# EAGLE design 328+ch340g (EAGLE 6.5.0)
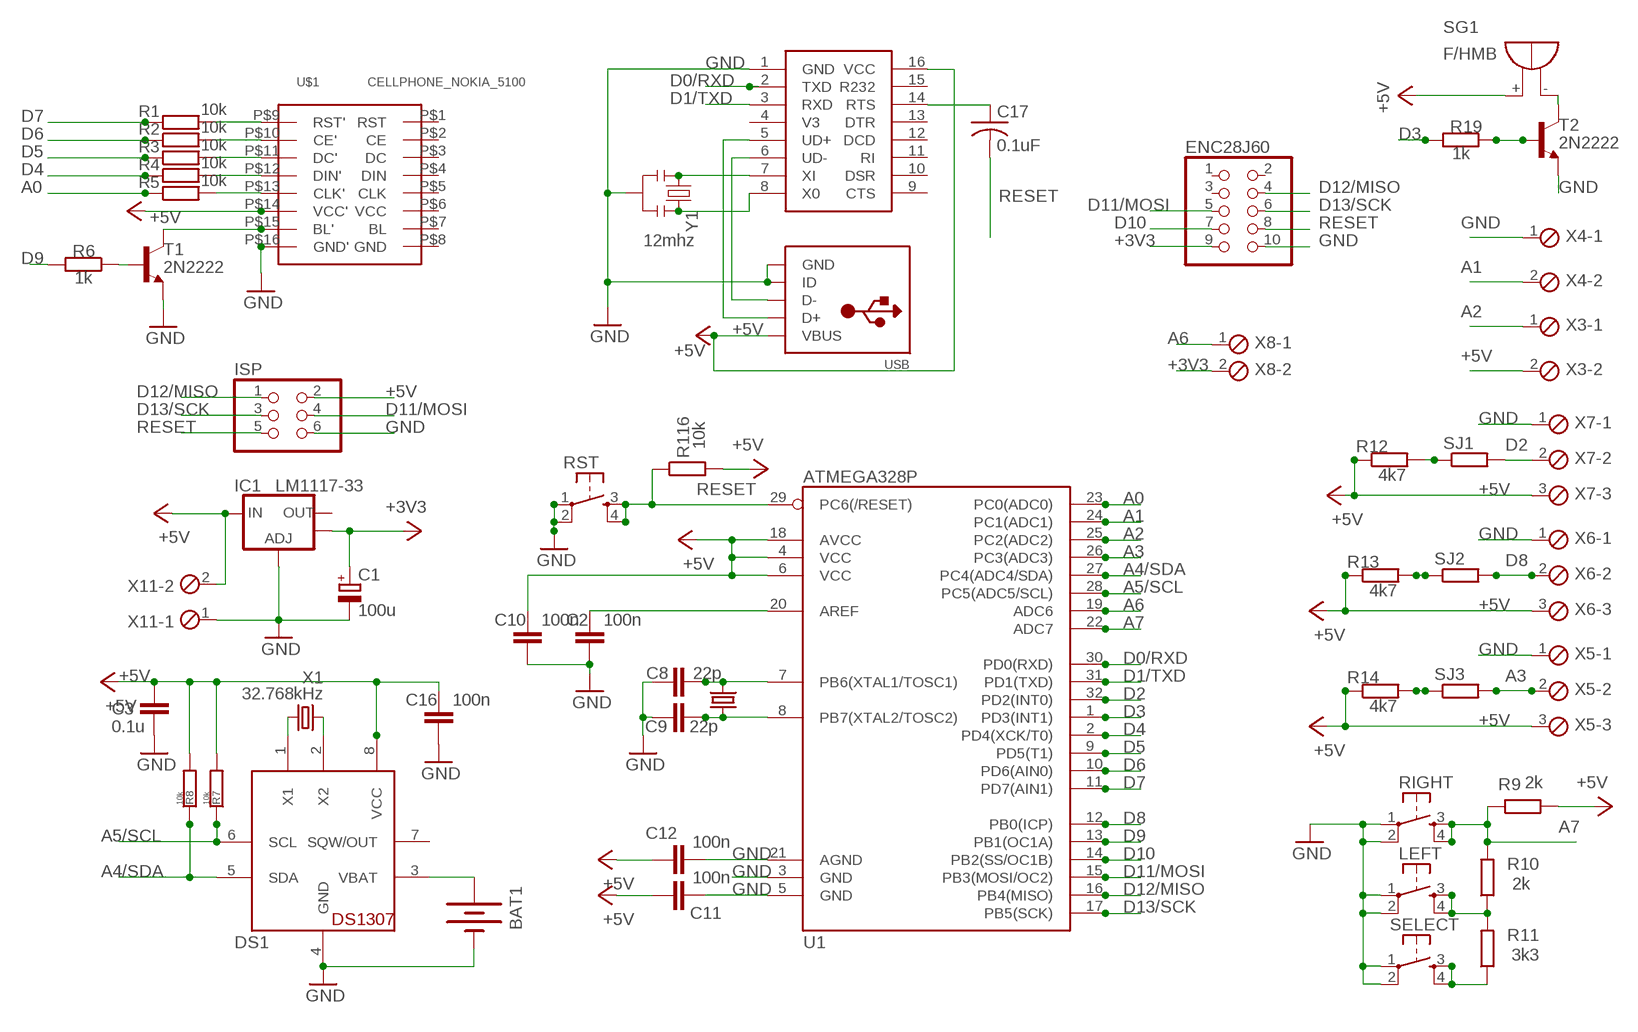
[diagram p0: schematic, sheet 1]

## Parts
BAT1  BATTERY20PTH  [BATTCOM_20MM_PTH]
C1  100u  CPOL-EUE2-5  [E2-5]
C2  100n  C-EUC0805  [C0805]
C3  0.1u  C-EUC0805  [C0805]
C8  22p  C-EUC0805  [C0805]
C9  22p  C-EUC0805  [C0805]
C10  100n  C-EUC0805  [C0805]
C11  100n  C-EUC0805  [C0805]
C12  100n  C-EUC0805  [C0805]
C16  100n  C-EUC0805  [C0805]
C17  0.1uF  C-USC0805K  [C0805K]
DS1  DS1307  DS1307SOIC  [SO08]
ENC28J60  PINHD-2X5  [2X05]
IC1  LM1117-33  V_REG_LM1117SOT223  [SOT223]
ISP  PINHD-2X3  [2X03]
LEFT  TAC_SWITCHPTH  [TACTILE-PTH]
R1  10k  R-EU_R0805  [R0805]
R2  10k  R-EU_R0805  [R0805]
R3  10k  R-EU_R0805  [R0805]
R4  10k  R-EU_R0805  [R0805]
R5  10k  R-EU_R0805  [R0805]
R6  1k  R-EU_R0805  [R0805]
R7  10k  R-EU_R0805  [R0805]
R8  10k  R-EU_R0805  [R0805]
R9  2k  R-EU_R0805  [R0805]
R10  2k  R-EU_R0805  [R0805]
R11  3k3  R-EU_R0805  [R0805]
R12  4k7  R-EU_R0805  [R0805]
R13  4k7  R-EU_R0805  [R0805]
R14  4k7  R-EU_R0805  [R0805]
R19  1k  R-EU_R0805  [R0805]
R116  10k  R-EU_R0805  [R0805]
RIGHT  TAC_SWITCHPTH  [TACTILE-PTH]
RST  TAC_SWITCHPTH  [TACTILE-PTH]
SELECT  TAC_SWITCHPTH  [TACTILE-PTH]
SG1  F/HMB  [F/HMB]
SJ1  R-EU_R0402  [R0402]
SJ2  R-EU_R0402  [R0402]
SJ3  R-EU_R0402  [R0402]
T1  2N2222  [TO92-EBC-OVAL]
T2  2N2222  [TO92-EBC-OVAL]
U1  ATMEGA328P  ATMEGA328_SMT  [TQFP32-08]
U$1  CELLPHONE_NOKIA_5100  [CELLPHONE_NOKIA_5100_SPARKFUN]
U$2  CH340G  [SO016]
USB  USBMOLEX  [USB-MINIB-THM-MOLEX]
X1  32.768kHz  CRYSTALTC26H  [TC26H]
X2  16MHz  CRYSTALHC49US  [HC49US]
X3  MPT2  [2POL254]
X4  MPT2  [2POL254]
X5  MPT3  [3POL254]
X6  MPT3  [3POL254]
X7  MPT3  [3POL254]
X8  MPT2  [2POL254]
X11  MPT2  [2POL254]
Y1  12mhz  RESONATORPTH  [RESONATOR-PTH]

## Nets
+3V3: C1.+ ENC28J60.9 IC1.4(OUT) X8.2
+5V: C3.1 C10.1 C11.2 C12.2 C16.1 DS1.8(VCC) IC1.3(IN) ISP.2 R7.2 R8.2 R9.2 R12.1 R13.1 R14.1 R116.2 SG1.+ U1.4(VCC) U1.6(VCC) U1.18(AVCC) U$1.P$14(VCC') U$2.16(VCC) USB.VBUS X3.2 X5.3 X6.3 X7.3 X11.2
A0: R5.1 U1.23(PC0(ADC0))
A1: U1.24(PC1(ADC1)) X4.2
A2: U1.25(PC2(ADC2)) X3.1
A3: SJ3.2 U1.26(PC3(ADC3)) X5.2
A4/SDA: DS1.5(SDA) R8.1 U1.27(PC4(ADC4/SDA))
A5/SCL: DS1.6(SCL) R7.1 U1.28(PC5(ADC5/SCL))
A6: U1.19(ADC6) X8.1
A7: R9.1 R10.2 RIGHT.3 RIGHT.4 U1.22(ADC7)
D0/RXD: U1.30(PD0(RXD)) U$2.2(TXD)
D1/TXD: U1.31(PD1(TXD)) U$2.3(RXD)
D2: SJ1.2 U1.32(PD2(INT0)) X7.2
D3: R19.2 U1.1(PD3(INT1))
D4: R4.1 U1.2(PD4(XCK/T0))
D5: R3.1 U1.9(PD5(T1))
D6: R2.1 U1.10(PD6(AIN0))
D7: R1.1 U1.11(PD7(AIN1))
D8: SJ2.2 U1.12(PB0(ICP)) X6.2
D9: R6.2 U1.13(PB1(OC1A))
D10: ENC28J60.7 U1.14(PB2(SS/OC1B))
D11/MOSI: ENC28J60.5 ISP.4 U1.15(PB3(MOSI/OC2))
D12/MISO: ENC28J60.4 ISP.1 U1.16(PB4(MISO))
D13/SCK: ENC28J60.6 ISP.3 U1.17(PB5(SCK))
GND: BAT1.2(-) C1.- C2.2 C3.2 C8.1 C9.1 C10.2 C11.1 C12.1 C16.2 DS1.4(GND) ENC28J60.10 IC1.1(ADJ) ISP.6 LEFT.1 LEFT.2 RIGHT.1 RIGHT.2 RST.1 RST.2 SELECT.1 SELECT.2 T1.E T2.E U1.3(GND) U1.5(GND) U1.21(AGND) U$1.P$16(GND') U$2.1(GND) USB.GND USB.ID X4.1 X5.1 X6.1 X7.1 X11.1 Y1.2
N$1: LEFT.3 LEFT.4 R10.1 R11.2
N$2: R5.2 U$1.P$13(CLK')
N$3: R4.2 U$1.P$12(DIN')
N$4: R3.2 U$1.P$11(DC')
N$5: R2.2 U$1.P$10(CE')
N$6: R1.2 U$1.P$9(RST')
N$7: BAT1.1(+) DS1.3(VBAT)
N$8: DS1.1(X1) X1.2
N$10: U$2.7(XI) Y1.1
N$11: U$2.6(UD-) USB.D-
N$15: U$2.5(UD+) USB.D+
N$17: R13.2 SJ2.1
N$18: R11.1 SELECT.3 SELECT.4
N$26 [signal]: T1.C U$1.P$15(BL')
N$27: R19.1 T2.B
N$28: R14.2 SJ3.1
N$29: SG1.- T2.C
N$30: DS1.2(X2) X1.1
N$31: R12.2 SJ1.1
N$32: C9.2 U1.8(PB7(XTAL2/TOSC2)) X2.1
N$33: C8.2 U1.7(PB6(XTAL1/TOSC1)) X2.2
N$35: C2.1 U1.20(AREF)
N$40: U$2.8(X0) Y1.3
N$43: C17.1 U$2.14(RTS)
N$44: R6.1 T1.B
RESET: C17.2 ENC28J60.8 ISP.5 R116.1 RST.3 RST.4 U1.29(PC6(/RESET))
Unconnected: DS1.7(SQW/OUT) ENC28J60.1 ENC28J60.2 ENC28J60.3 IC1.2(OUT) U$1.P$1(RST) U$1.P$2(CE) U$1.P$3(DC) U$1.P$4(DIN) U$1.P$5(CLK) U$1.P$6(VCC) U$1.P$7(BL) U$1.P$8(GND) U$2.4(V3) U$2.9(CTS) U$2.10(DSR) U$2.11(RI) U$2.12(DCD) U$2.13(DTR) U$2.15(R232)

## Library data of the parts
BAT1 = SparkFun-Electromechanical:BATTERY: Battery Holders Various common sizes : AA, AAA, 20mm coin cell and 12mm coin cell. 20MM_4LEGS, BATT-10373
C1 = resistor:CPOL-EU: POLARIZED CAPACITOR, European symbol
C2 C8-C12 C16 = resistor:C-EU: CAPACITOR, European symbol
C3 = rcl:C-EU: CAPACITOR, European symbol
C17 = rcl:C-US: CAPACITOR, American symbol
DS1 = adafruit:DS1307: DS1307 Real time clock (RTC) with battery backup ability. Talk to it via i2c
ENC28J60 = pinhead:PINHD-2X5: PIN HEADER
IC1 = SparkFun:V_REG_LM1117: Voltage Regulator LM1117 Standard adjustable voltage regulator but in SMD form. Spark Fun Electronics SKU : COM-00595
ISP = pinhead:PINHD-2X3: PIN HEADER
LEFT RIGHT RST SELECT = SparkFun-Electromechanical:TAC_SWITCH: Momentary Switch Button commonly used for reset or general input. Spark Fun Electronics SKU : COM-00097 SMT- SWCH-08247
R1-R14 R19 R116 SJ1-SJ3 = rcl:R-EU_: RESISTOR, European symbol
SG1 = buzzer:F/HMB: BUZZER Source: Buerklin; OC_FARNELL: unknown; OC_NEWARK: unknown
T1 T2 = adafruit:2N2222: NPN TRANSISTOR Big oval pads
U1 = SparkFun-DigitalIC:ATMEGA328_SMT: 32-Pin Atmega328 part Commonly used on Arduino compatible boards Available in QFP and QFN packages TQFP is IC-09069 QFN is non-stock; PROD_ID: IC-09069
U$1 = DIY-Cellphone:CELLPHONE_NOKIA_5100
U$2 = ch340:CH340G: CH340G
USB = adafruit:USB: USB Connectors USBMINIB - Surface Mount Female Mini-B USB Connector 4UConnector: 06564 By microbuilder.eu Thru-hole RA Female Mini-B USB Connector 4UConnector: 18732 By ladyada.net
X1 = crystal:CRYSTAL: CRYSTAL; OC_FARNELL: unknown; OC_NEWARK: unknown
X2 = SparkFun:CRYSTAL: Crystals Various standard crystals. Proven footprints. Spark Fun Electronics SKU : COM-00534
X3 X4 X8 X11 = con-phoenix-254:MPT2: PHOENIX CONNECTOR; OC_FARNELL: unknown; OC_NEWARK: unknown
X5-X7 = con-phoenix-254:MPT3: PHOENIX CONNECTOR; OC_FARNELL: unknown; OC_NEWARK: unknown
Y1 = SparkFun-FreqCtrl:RESONATOR: Resonator Small SMD resonator. Used, eg, on the Arduino Pro/ Pro Mini boards. 8MHz- XTAL-08895 16MHz- XTAL-08900

## Net classes
0 default: width 0.406 mm, clearance 0.203 mm
1 power: width 0.61 mm, clearance 0.203 mm
2 GND: width 0.61 mm
3 signal: width 0.457 mm

## Board
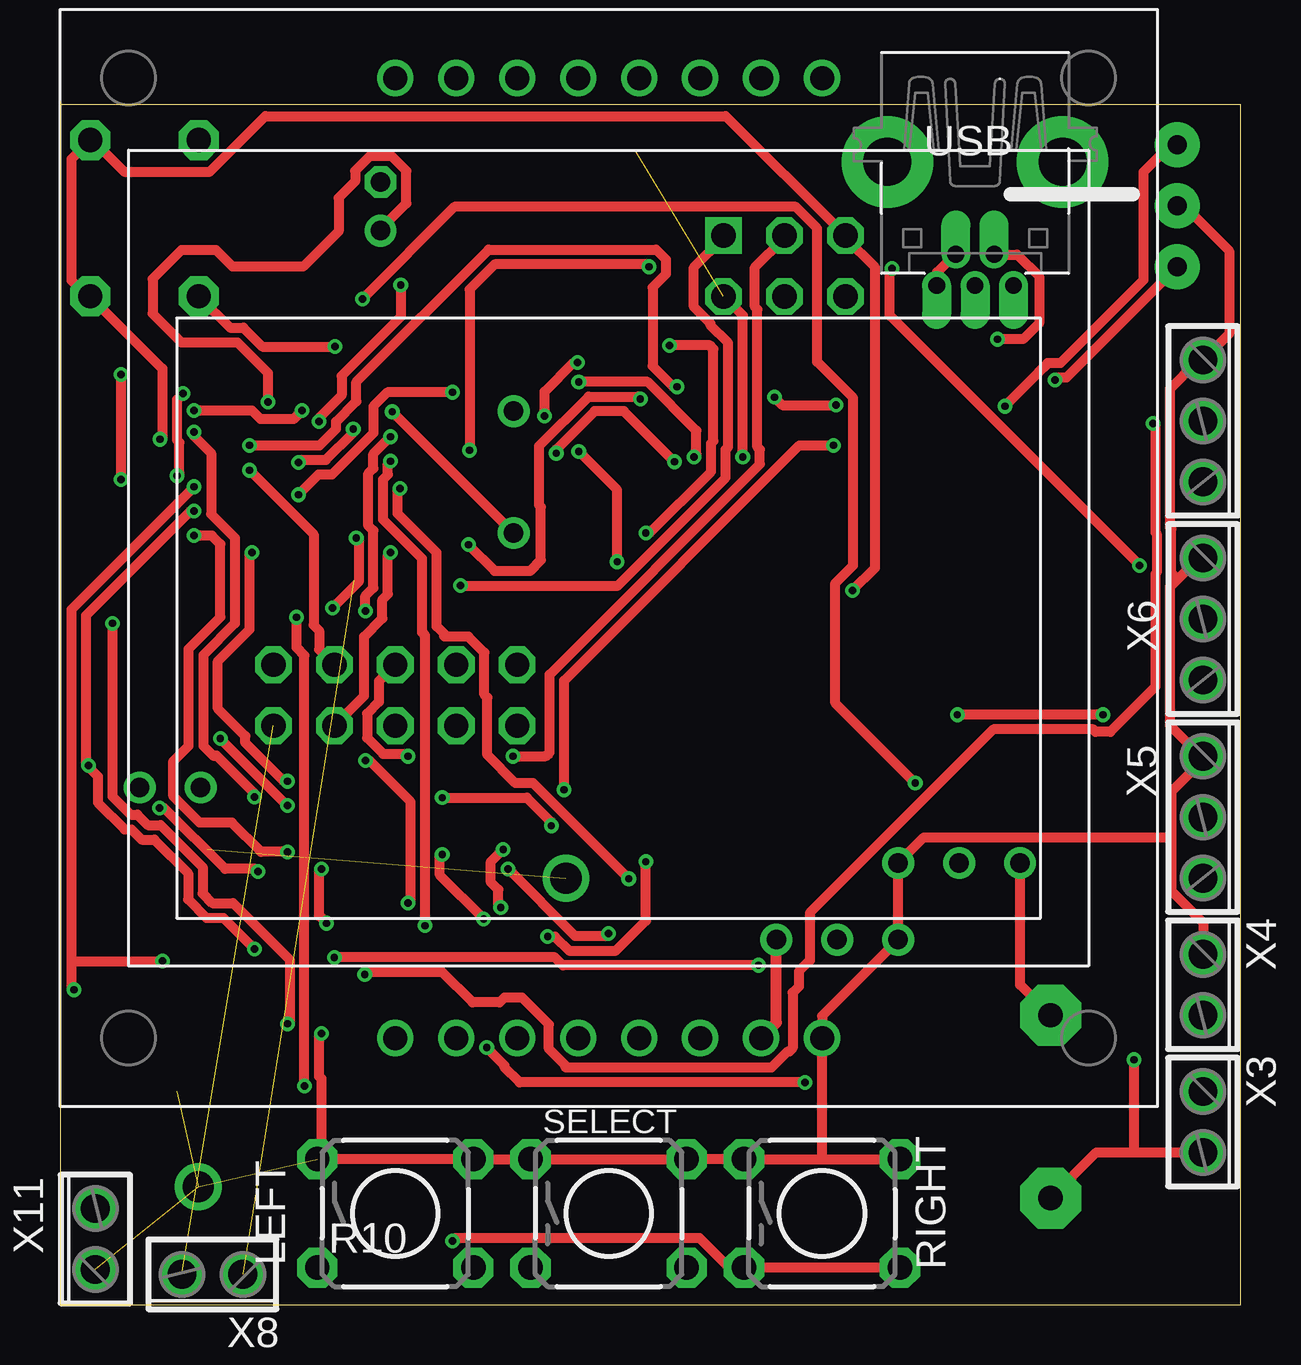
[diagram p1: board, top side]
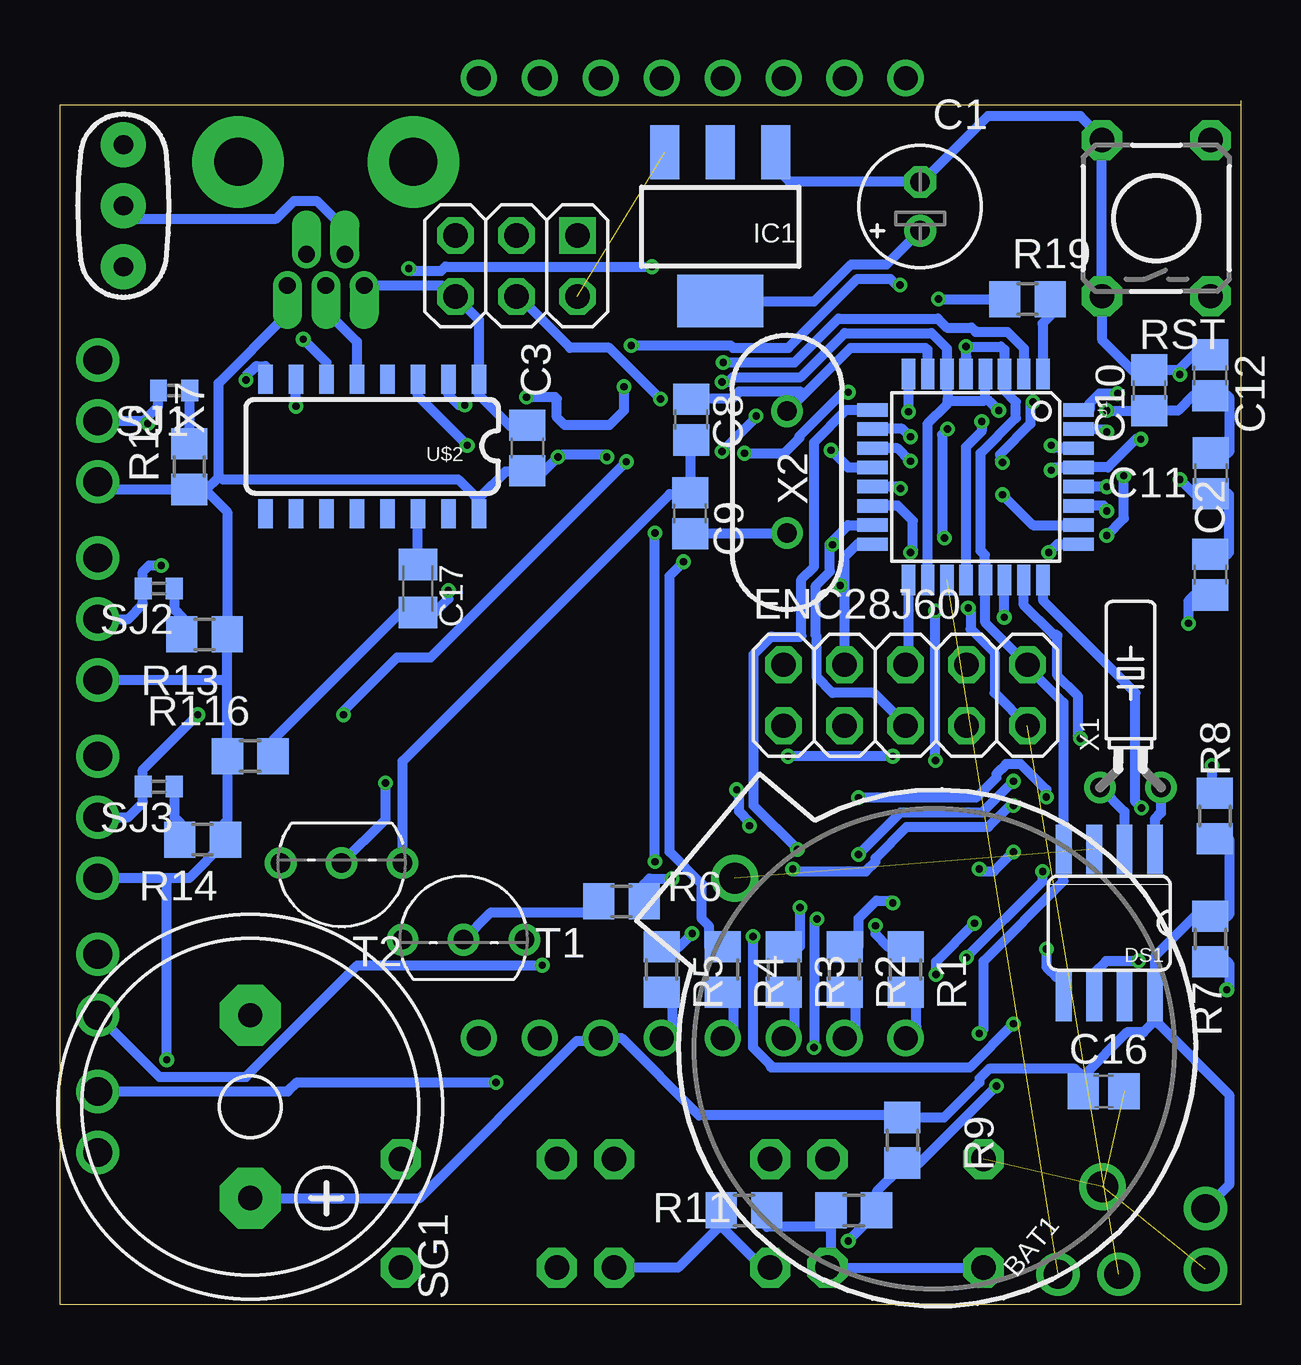
[diagram p2: board, bottom side, seen from below]

Size 49.2 x 50.16 mm. Coordinates in mm from the lower left corner, seen from the top.
Outline: 0,50 49.2,50 49.2,0 0,0 0,50.16
Copper layers (1*16): Top 0.035mm / dielectric 1.5mm / Bottom 0.035mm
Design rules "dirt_cheap_dirty_boards.v1": minimum track width 5mil, minimum drill 12mil, track to track 5mil, track to pad 5mil, pad to pad 5mil, via to via 5mil, smd to smd 0mil, copper to edge 10mil, drill to drill 10mil, minimum pad ring 10mil, minimum via ring 6mil, stop-mask expansion 2mil, vias tented up to drill 25mil, thermal gap 10mil
vRestrict: area 32,73 to 71,78

### Footprints (pad centres in the part's own frame; a part is rotated, then mirrored left to right if it is on the bottom)
BATTCOM_20MM_PTH = drill 1.3: 1 20,0; 2 0,0
E2-5 = drill 0.813 pad 1.27: + -1.016,0 | drill 0.813 pad 1.27 octagon: - 1.016,0
C0805 = smd 1.3 x 1.5: 1 -0.85,0; 2 0.85,0
C0805' = smd 1.3 x 1.5: 1 -0.95,0; 2 0.95,0
C0805K = smd 1.3 x 1.6: 1 -1,0; 2 1,0
SO08 = smd 0.66 x 2.032: 1 -1.905,-3.073; 2 -0.635,-3.073; 3 0.635,-3.073; 4 1.905,-3.073; 5 1.905,3.073; 6 0.635,3.073; 7 -0.635,3.073; 8 -1.905,3.073
2X05 = drill 1.016 octagon: 1 -5.08,-1.27; 2 -5.08,1.27; 3 -2.54,-1.27; 4 -2.54,1.27; 5 0,-1.27; 6 0,1.27; 7 2.54,-1.27; 8 2.54,1.27; 9 5.08,-1.27; 10 5.08,1.27
SOT223 = smd 1.219 x 2.235: 1 -2.311,-3.099; 2 0,-3.099; 3 2.311,-3.099 | smd 3.6 x 2.2: 4 0,3.099
2X03 = drill 1.016 square: 1 -2.54,-1.27 | drill 1.016 octagon: 2 -2.54,1.27; 3 0,-1.27; 4 0,1.27; 5 2.54,-1.27; 6 2.54,1.27
TACTILE-PTH = drill 1.016 pad 1.676 octagon: 1 -3.251,2.261; 2 3.251,2.261; 3 -3.251,-2.261; 4 3.251,-2.261
R0805 = smd 1.3 x 1.5: 1 -0.95,0; 2 0.95,0
F/HMB = drill 1.016 pad 2.54 octagon: + 3.81,0; - -3.81,0
R0402 = smd 0.7 x 0.9: 1 -0.65,0; 2 0.65,0
TO92-EBC-OVAL = drill 0.813: B 0,-1.27; C 2.54,-1.27; E -2.54,-1.27
TQFP32-08 = smd 1.27 x 0.559: 1 -4.293,2.8; 2 -4.293,2; 3 -4.293,1.2; 4 -4.293,0.4; 5 -4.293,-0.4; 6 -4.293,-1.2; 7 -4.293,-2; 8 -4.293,-2.8; 17 4.293,-2.8; 18 4.293,-2; 19 4.293,-1.2; 20 4.293,-0.4; 21 4.293,0.4; 22 4.293,1.2; 23 4.293,2; 24 4.293,2.8 | smd 0.559 x 1.27: 9 -2.8,-4.293; 10 -2,-4.293; 11 -1.2,-4.293; 12 -0.4,-4.293; 13 0.4,-4.293; 14 1.2,-4.293; 15 2,-4.293; 16 2.8,-4.293; 25 2.8,4.293; 26 2,4.293; 27 1.2,4.293; 28 0.4,4.293; 29 -0.4,4.293; 30 -1.2,4.293; 31 -2,4.293; 32 -2.8,4.293
CELLPHONE_NOKIA_5100_SPARKFUN = drill 1: P$1 -8.89,20; P$2 -6.35,20; P$3 -3.81,20; P$4 -1.27,20; P$5 1.27,20; P$6 3.81,20; P$7 6.35,20; P$8 8.89,20; P$9 -8.89,-20; P$10 -6.35,-20; P$11 -3.81,-20; P$12 -1.27,-20; P$13 1.27,-20; P$14 3.81,-20; P$15 6.35,-20; P$16 8.89,-20
SO016 = smd 0.6 x 1.2: 1 -4.445,-2.8; 2 -3.175,-2.8; 3 -1.905,-2.8; 4 -0.635,-2.8; 5 0.635,-2.8; 6 1.905,-2.8; 7 3.175,-2.8; 8 4.445,-2.8; 9 4.445,2.8; 10 3.175,2.8; 11 1.905,2.8; 12 0.635,2.8; 13 -0.635,2.8; 14 -1.905,2.8; 15 -3.175,2.8; 16 -4.445,2.8
USB-MINIB-THM-MOLEX = drill 0.7 offset: D+ 0,9.72; D- -0.8,8.42; GND 1.6,9.72; ID 0.8,8.42; VBUS -1.6,9.72 | drill 2 pad 3.81: GND1 -3.65,4.57; GND4 3.65,4.57
TC26H = drill 0.813: 1 -1.27,0; 2 1.27,0
HC49US = drill 0.813: 1 -2.54,0; 2 2.54,0
2POL254 = drill 1.2: 1 -1.27,0; 2 1.27,0
3POL254 = drill 1.2: 1 -2.54,0; 2 0,0; 3 2.54,0
RESONATOR-PTH = drill 0.8 pad 1.88: 1 -2.54,0; 2 0,0; 3 2.54,0

### Placement (x,y rotation side)
BAT1  5.76,4.92 140 bottom
C1  13.36,45.77 90 bottom
C2  1.26,30.43 90 bottom
C3  0.1u  [C0805']  29.72,35.7 90 bottom
C8  22.89,36.88 90 bottom
C9  22.95,32.98 270 bottom
C10  3.81,38.1 90 bottom
C11  1.24,34.65 90 bottom
C12  1.27,38.73 270 bottom
C16  5.71,8.89 0 bottom
C17  34.29,29.84 270 bottom
DS1  5.48,15.91 180 bottom
ENC28J60  13.97,25.4 0 bottom
IC1  21.69,44.92 180 bottom
ISP  30.18,43.29 180 bottom
LEFT  13.97,3.81 0 top
R1  13.97,13.97 270 bottom
R2  16.51,13.97 270 bottom
R3  19.05,13.97 270 bottom
R4  21.59,13.97 270 bottom
R5  24.13,13.97 270 bottom
R6  25.81,16.81 0 bottom
R7  1.27,15.24 90 bottom
R8  1.08,20.37 270 bottom
R9  14.1,6.86 90 bottom
R10  16.13,3.94 0 bottom
R11  20.7,3.94 0 bottom
R12  43.81,34.92 90 bottom
R13  43.18,27.94 180 bottom
R14  43.26,19.38 180 bottom
R19  8.89,41.91 0 bottom
R116  41.27,22.86 180 bottom
RIGHT  31.75,3.81 0 top
RST  3.52,45.28 90 bottom
SELECT  22.86,3.81 0 top
SG1  41.27,8.26 270 bottom
SJ1  44.45,38.1 180 bottom
SJ2  45.09,29.84 180 bottom
SJ3  45.09,21.59 180 bottom
T1  32.38,16.48 0 bottom
T2  37.47,17.14 180 bottom
U1  11.05,34.49 270 bottom
U$1  22.86,31.11 0 top
U$2  36.2,35.76 180 bottom
USB  38.13,52.2 180 top
X1  4.59,21.56 0 bottom
X2  18.91,34.7 90 bottom
X3  47.62,7.62 270 top
X4  47.62,13.34 270 top
X5  47.62,20.32 270 top
X6  47.62,28.57 270 top
X7  47.62,36.83 270 top
X8  6.35,1.27 180 top
X11  1.47,2.74 90 top
Y1  46.56,45.8 270 bottom

### Tracks (layer width: path | path; a pad name or v marks a point on that pad's centre or on a via)
+3V3  (via drill 0.3)  (1 unrouted)
  Top 0.406: v11.35,29.03 12.45,30.12 12.45,31.85 v12.34,31.95 | v12.22,36.5 12.22,36.35 11.07,35.2 10.03,35.2 v9.93,35.1 | v8.66,37.62 8.66,38.84 7.39,40.11 5.05,40.11 3.86,41.3 3.86,42.75 5.05,43.94 6.5,43.94 7.19,43.26 10.13,43.26 11.61,44.73 11.61,46.13 12.29,46.81 12.29,47.24 12.9,47.85 13.82,47.85 14.43,47.24 14.43,45.9 13.36,44.83 C1.+
  Bottom 0.406: C1.+ 14.76,43.36 16.23,43.36 17.78,41.81 20.95,41.81 20.98,41.83 21.67,41.83 IC1.4 | ENC28J60.9 10.26,25.5 10.26,27.18 11.25,28.17 11.25,28.93 v11.35,29.03 | v12.34,31.95 12.45,32.05 12.45,36.27 v12.22,36.5 | v9.93,35.1 10.03,35.2 10.03,35.43 8.76,36.7 8.76,37.52 v8.66,37.62
+5V  (via drill 0.3)  (1 unrouted)
  Top 0.406: v5.59,37.26 8,37.26 8.36,36.91 9.73,36.91 v10.08,37.26 | v28.45,35.33 28.45,41.22 27.66,42.01 ISP.2 | v21.61,38.46 24.49,38.46 26.52,36.42 26.52,35.43 v26.42,35.33 | 44.76,6.35 43.18,6.35 SG1.+ | 44.76,6.35 X3.2 | 44.76,6.35 v44.76,10.21
  Bottom 0.406: R8.2 1.07,19.43 0.51,19.43 0.48,19.41 0.48,16.26 0.56,16.18 R7.2 1.45,16.18 1.93,16.18 3.56,14.55 3.56,13.56 3.58,13.54 3.58,13.03 DS1.8 3.58,12.83 3.58,12.14 3.61,12.12 3.61,11.81 | 6.55,9.55 C16.1 | 6.55,9.55 4.75,11.35 4.06,11.35 3.61,11.81 | 6.55,9.55 6.73,9.65 6.91,9.83 10.49,9.83 10.9,9.42 10.9,9.27 12.37,7.8 14.1,7.8 R9.2 14.28,7.9 22.58,7.9 25.78,11.1 U$1.P$14 26.85,11 27.66,11 34.21,4.45 SG1.+ | X11.2 0.48,5 0.48,8.76 3.43,11.71 3.61,11.81 | 42.24,26.04 42.24,23.6 42.22,23.57 42.22,23.04 R116.2 42.22,22.86 42.22,20.19 42.32,20.09 R14.1 42.39,19.2 43.81,17.78 44.76,17.78 | 42.24,26.04 R13.1 42.24,28.12 42.24,33.05 43,33.81 43.1,33.98 | 42.24,26.04 X6.3 | C11.2 1.25,35.48 0.53,35.48 0.48,35.53 0.48,37.82 0.56,37.9 1.27,37.9 C12.2 1.45,37.9 1.98,37.9 2.62,37.26 3.81,37.26 C10.1 3.99,37.26 v5.59,37.26 | 10.64,37.74 10.64,38.76 U1.4 | 10.64,37.74 10.72,37.67 12.17,37.67 | 12.17,37.67 12.22,37.72 12.22,38.05 12.24,38.08 12.24,38.76 U1.6 12.24,38.96 12.24,39.85 12.88,40.49 16.51,40.49 18.34,38.66 21.16,38.66 21.36,38.46 v21.61,38.46 | U1.18 13.06,36.7 12.27,37.49 12.17,37.67 | v10.08,37.26 10.46,37.64 10.64,37.74 | 31.75,33.6 U$2.16 | 31.75,33.6 30.63,34.72 30.45,34.72 30.43,34.75 29.74,34.75 C3.1 29.52,34.75 29.03,34.75 v28.45,35.33 28.27,35.43 26.52,35.43 v26.42,35.33 | X7.3 47.32,33.98 43.81,33.98 R12.1 43.64,33.98 43.1,33.98 | 42.6,34.49 42.6,38.41 39.75,41.25 39.75,42.47 USB.VBUS | 43.1,33.98 42.6,34.49 | 31.75,33.6 31.93,33.71 32.61,34.39 42.42,34.39 42.6,34.49 | 44.76,17.78 X5.3 | v44.76,10.21 44.76,17.78
A0  (via drill 0.3)
  Top 0.406: v9.47,20.8 v6.68,23.6 | v18.67,18.16 21.46,15.37 22.76,15.37 v22.86,15.47
  Bottom 0.406: v6.68,23.6 6.78,23.7 6.78,25.35 7.64,26.21 7.64,27.89 7.67,27.91 7.8,27.91 9.04,29.16 9.04,30.18 U1.23 | v9.47,20.8 9.63,20.8 10.52,19.91 13.92,19.91 15.21,18.62 15.21,18.47 15.62,18.06 18.57,18.06 v18.67,18.16 | v22.86,15.47 23.42,14.91 R5.1
A1  (via drill 0.3)
  Top 0.406: v4.14,20.7 4.34,20.7 6.88,18.16 8.15,18.16 v8.26,18.06 | v11.43,14.48 20.62,14.48 20.95,14.15 v29.11,14.15
  Bottom 0.406: v4.14,20.7 4.39,20.95 4.39,25.5 8.23,29.34 8.23,30.18 U1.24 | v8.26,18.06 8.26,17.65 v11.43,14.48 | v29.11,14.15 36.8,14.15 41.45,9.5 45.06,9.5 X4.2
A2  (via drill 0.3)
  Top 0.406: v8,31.34 7.9,31.24 7.9,28.14 6.58,26.82 6.58,24.84 7.72,23.7 7.72,23.42 9.32,21.82 v9.47,21.82 | v15.93,18.77 15.82,18.67 15.82,17.91 v17.65,16.08 | v17.78,10.72 18.52,9.98 18.52,9.91 19.15,9.27 v31.04,9.27
  Bottom 0.406: v8,31.34 7.64,31.7 U1.25 | v9.47,21.82 10.77,20.52 14.17,20.52 v15.93,18.77 | v17.65,16.08 17.75,15.98 17.75,10.74 v17.78,10.72 | v31.04,9.27 39.32,9.27 39.7,8.89 X3.1
A3  (via drill 0.3)
  Top 0.406: v9.93,33.76 10.77,34.59 11.33,34.59 13.06,36.32 13.06,37.44 13.64,38.02 v16.36,38.02 | v20.68,35.48 20.68,35.64 22.28,37.24 23.5,37.24 v25.6,35.13 | v43.46,24.59 v37.39,24.59
  Bottom 0.406: X5.2 46.35,20.32 45.74,20.93 45.74,21.59 SJ3.2 45.74,21.77 45.74,22.3 v43.46,24.59 | v9.93,33.76 8.66,32.49 U1.26 | v16.36,38.02 16.38,38.05 16.54,38.05 18.39,36.2 18.39,36.12 19.02,35.48 v20.68,35.48 | v25.6,35.13 33.76,26.98 35.15,26.98 37.39,24.74 v37.39,24.59
A4/SDA  (via drill 0.3)
  Top 0.406: v5.59,33.07 5.44,33.07 1.09,28.73 1.09,22.58 v1.19,22.48 1.29,22.3 1.57,22.02 1.57,20.93 2.69,19.81 2.97,19.81 3.4,19.38 3.94,19.38 5.33,17.98 5.33,16.89 6.1,16.13 6.81,16.13 v8.1,14.83
  Bottom 0.406: v5.59,33.07 5.59,33.17 5.71,33.3 6.73,33.3 U1.27 | v1.19,22.48 1.19,21.31 1.09,21.31 R8.1 | v8.1,14.83 8.1,14.07 7.7,13.66 7.57,13.66 7.39,13.49 7.39,12.85 DS1.5
A5/SCL  (via drill 0.3)
  Top 0.406: v5.59,34.09 0.48,28.98 0.48,14.33 | 0.48,14.33 0.48,13.23 v0.58,13.13 | 0.48,14.33 v4.27,14.33
  Bottom 0.406: v5.59,34.09 6.73,34.09 U1.28 | v0.58,13.13 0.48,13.23 0.48,14.22 0.56,14.3 R7.1 | v4.27,14.33 5.61,14.33 6.12,13.82 6.12,12.85 DS1.6
A6  (1 unrouted)
A7  (via drill 0.3)
  Top 0.406: RIGHT.4 RIGHT.3 28.32,1.65 27.79,1.65 26.64,2.79 16.48,2.79 v16.36,2.67 | v9.86,28.65 9.86,27.38 10.19,27.05 v10.19,9.12
  Bottom 0.406: v9.86,28.65 9.86,30.18 U1.22 | v10.19,9.12 13.39,5.92 R9.1 14.17,5.71 15.16,4.72 15.16,3.94 R10.2 15.27,3.76 v16.36,2.67
D0/RXD  (via drill 0.3)
  Top 0.406: v32.33,37.49 30.1,37.49 v29.77,37.82 | v25.7,38.25 25.55,38.25 24.69,39.12 24.69,42.39 25.25,42.95 25.25,43.56 24.84,43.97 17.86,43.97 12.34,38.46 12.34,37.64 11.51,36.8 11.51,36.5 10.82,35.81 v7.9,35.81
  Bottom 0.406: U$2.2 33.02,37.92 32.59,37.49 v32.33,37.49 | v29.77,37.82 28.57,37.82 28.5,37.74 28.5,36.98 28.17,36.65 26.31,36.65 25.7,37.26 v25.7,38.25 | v7.9,35.81 7.8,35.71 7.47,35.71 7.44,35.69 U1.30
D1/TXD  (via drill 0.3)
  Top 0.406: v32.23,35.81 30.81,35.81 21.01,26.01 v21.01,21.46 | v20.47,19.96 20.47,20.12 19.46,21.13 v15.93,21.13 | v8.1,21.16 8.1,21.31 6.53,22.89 6.38,22.89 5.97,23.29 5.97,27.08 7.29,28.4 7.29,31.95 6.3,32.94 6.3,35.48 5.59,36.2 v5.59,36.37
  Bottom 0.406: U$2.3 34.29,37.87 v32.23,35.81 | v21.01,21.46 20.9,21.36 20.9,20.55 20.47,20.12 v20.47,19.96 | v15.93,21.13 11.02,21.13 10.19,21.97 10.19,22.12 9.78,22.53 9.17,22.53 8.1,21.46 v8.1,21.16 | v5.59,36.37 5.69,36.47 6.02,36.47 6.04,36.5 6.73,36.5 U1.31
D2  (via drill 0.3)
  Top 0.406: v5.13,37.97 4.88,37.72 4.88,36.04 4.98,35.94 4.98,34.65 v4.88,34.54 | v5.59,32.05 6.33,32.05 6.68,31.7 6.68,28.65 5.36,27.33 5.36,23.29 4.72,22.66 4.72,21.18 5.82,20.09 7.16,20.09 8.38,18.87 v9.47,18.87 | v10.9,18.16 10.79,18.06 10.79,16.2 v11.1,15.9 | v12.7,13.77 12.8,13.87 15.93,13.87 17.2,12.6 18.31,12.6 18.52,12.8 19.25,12.8 20.37,11.68 20.37,10.67 21.06,9.98 21.06,9.91 21.08,9.88 29.64,9.88 30.33,10.57 30.4,10.57 30.53,10.69 30.53,13.01 30.79,13.26 30.79,13.89 31.24,14.35 31.24,16.33 38.89,23.98 43.05,23.98 43.16,23.88 43.76,23.88 45.64,25.76 45.64,30.45 45.7,30.5 45.7,32.13 45.64,32.18 45.64,36.63 v45.54,36.73
  Bottom 0.406: 45.68,36.87 45.72,36.83 X7.2 | 45.68,36.87 45.11,37.44 SJ1.2 | v5.13,37.97 5.89,37.97 6.3,37.57 6.3,37.29 6.73,37.29 U1.32 | v4.88,34.54 4.88,32.77 v5.59,32.05 | v9.47,18.87 10.29,18.06 10.79,18.06 v10.9,18.16 | v11.1,15.9 12.7,14.3 v12.7,13.77 | v45.54,36.73 45.68,36.87
D3
  Bottom 0.406: U1.1 8.26,40.89 7.95,41.2 R19.2
D4  (via drill 0.3)
  Top 0.406: v21.57,39.27 21.41,39.27 20.19,38.05 v20.19,37.03 | v21.61,35.56 23.22,33.96 v23.22,30.96
  Bottom 0.406: v21.57,39.27 18.59,39.27 16.76,41.1 12.62,41.1 12.24,40.72 11.23,40.72 11.05,40.54 9.73,40.54 9.04,39.85 U1.2 | v20.19,37.03 20.19,36.98 v21.61,35.56 | v23.22,30.96 23.8,30.38 23.8,18.87 22.45,17.53 22.45,16.08 22.15,15.77 22.15,14.91 R4.1
D5  (via drill 0.3)
  Top 0.406: v18.47,18.97 17.96,18.47 17.96,17.6 18.26,17.3 18.26,16.66 v18.36,16.56
  Bottom 0.406: v18.47,18.97 20.3,20.8 20.3,27.1 19.56,27.84 18.34,27.84 18.31,27.86 18.31,30.23 17.78,30.76 17.78,35.94 16.43,37.29 U1.9 | v18.36,16.56 18.36,14.94 18.39,14.91 R3.1
D6  (via drill 0.3)
  Top 0.406: v13.77,36.17 13.06,35.46 13.06,34.85 12.85,34.65 12.85,32.46 13.06,32.26 13.06,29.87 12.72,29.54 v12.72,28.91 | v12.72,22.68 12.88,22.68 14.61,20.95 14.61,16.84 v14.5,16.74
  Bottom 0.406: v13.77,36.17 14.1,36.5 15.32,36.5 U1.10 | v12.72,22.68 v12.72,28.91 | v14.5,16.74 14.61,16.84 15.19,16.84 15.93,16.1 15.93,14.94 15.95,14.91 R2.1
D7  (via drill 0.3)
  Top 0.406: v13.77,35.15 13.66,35.05 13.66,34.59 13.46,34.39 13.46,32.72 15.09,31.09 15.09,28.02 15.21,27.89 v15.21,15.8
  Bottom 0.406: v13.77,35.15 14.3,35.69 15.32,35.69 U1.11 | v15.21,15.8 15.21,15.44 14.68,14.91 R1.1
D8  (via drill 0.3)
  Top 0.406: v17.07,35.61 17.07,42.32 18.11,43.36 24.43,43.36 v24.54,43.26 | v34.67,43.18 34.57,43.08 34.57,41.22 v44.98,30.81
  Bottom 0.406: X6.2 46.35,28.57 45.74,29.18 45.74,29.84 SJ2.2 45.74,30.02 45.74,30.56 45.49,30.81 v44.98,30.81 | v17.07,35.61 16.36,34.9 U1.12 | v24.54,43.26 33.15,43.26 33.33,43.08 34.57,43.08 v34.67,43.18
D9  (via drill 0.3)
  Top 0.406: v14.17,34.01 14.07,33.91 14.07,32.97 15.7,31.34 15.7,28.27 16,27.96 16,27.86 16.03,27.84 17.02,27.84 17.68,27.18 17.68,25.43 17.8,25.3 17.8,22.91 18.97,21.74 19.71,21.74 v23.7,17.75
  Bottom 0.406: v14.17,34.01 14.25,34.09 15.32,34.09 U1.13 | v23.7,17.75 24.64,17.75 24.87,17.53 R6.2
D10  (via drill 0.3)
  Top 0.406: v13.77,31.34 13.66,31.24 13.66,29.62 13.44,29.39 13.44,28.6 12.68,27.84 12.68,25.38 ENC28J60.7
  Bottom 0.406: v13.77,31.34 13.66,31.45 13.66,32.66 14.3,33.3 15.32,33.3 U1.14
D11/MOSI  (via drill 0.3)
  Top 0.406: v24.18,37.74 24.08,37.85 22.02,37.85 19.96,35.79 19.96,33.33 20.04,33.25 20.04,31.04 19.58,30.58 18.11,30.58 v17.02,31.67
  Bottom 0.406: 17.09,31.75 17.12,31.73 17.12,30.56 17.7,29.97 17.7,27.86 17.68,27.84 17.68,26.16 17.02,25.5 15.29,25.5 13.97,24.18 ENC28J60.5 | 17.09,31.75 16.36,32.49 U1.15 | v24.18,37.74 26.31,39.88 27.94,39.88 30.07,42.01 ISP.4 | v17.02,31.67 17.09,31.75
D12/MISO  (via drill 0.3)
  Top 0.406: v16.69,29.97 23.24,29.97 27.74,34.47 27.74,35.64 27.84,35.74 27.84,40.08 27.1,40.82 27.1,40.89 26.42,41.58 26.42,43.23 27.64,44.45 ISP.1
  Bottom 0.406: ENC28J60.4 16.51,29.97 | 16.51,29.97 16.51,31.17 15.98,31.7 U1.16 | v16.69,29.97 16.51,29.97
D13/SCK  (via drill 0.3)
  Top 0.406: v18.87,22.86 20.24,22.86 20.4,23.01 20.4,26.26 29.16,35.03 29.16,35.64 29.06,35.74 29.06,41.48 28.96,41.58 28.96,43.23 30.18,44.45 ISP.3 | v14.5,22.86 14.5,22.94 14.48,22.96 13.46,22.96 12.8,23.62 12.8,24.64 13.28,25.12 13.28,25.98 ENC28J60.6
  Bottom 0.406: ENC28J60.6 13.84,26.8 13.84,30.18 U1.17 | v14.5,22.86 v18.87,22.86
GND  (via drill 0.3)  (3 unrouted)
  Top 0.406: USB.GND 36.55,42.49 36.55,43.03 37.31,43.79 USB.ID | Y1.2 46.84,45.8 48.72,43.92 48.72,40.46 X7.1 47.45,39.27 47.35,39.27 46.25,38.18 46.25,32.38 46.3,32.33 46.3,30.5 46.57,30.24 | X6.1 47.45,31.11 46.57,30.24 | 46.57,30.24 46.25,29.92 46.25,24.13 47.35,23.04 X5.1 47.57,22.66 46.3,21.39 46.3,19.48 | v2.54,38.76 v2.54,34.39 | v11.46,39.93 8.43,39.93 7.64,40.72 7.09,40.72 5.79,42.01 RST.1 | 31.75,6.07 RIGHT.1 SELECT.2 SELECT.1 LEFT.2 LEFT.1 10.9,6.25 10.9,9.42 10.79,9.53 10.79,11.2 v10.9,11.3 | 31.75,6.07 RIGHT.2 | 31.75,6.07 U$1.P$16 31.75,12.04 T1.E T2.E 35.99,19.48 46.3,19.48 | X4.1 47.62,15.93 46.3,17.25 46.3,19.48
  Bottom 0.406: C3.2 29.74,36.65 30.43,36.65 30.45,36.63 31.75,37.92 U$2.1 31.75,41.05 ISP.6 32.92,42.09 33.3,42.47 USB.GND | Y1.2 46.02,45.26 40.18,45.26 39.45,46 38.51,46 37.34,44.83 USB.ID | 11.33,39.93 9.98,39.93 9.86,39.8 U1.3 9.86,38.58 9.86,38.1 9.37,37.62 9.37,36.96 10.85,35.48 10.85,31.42 10.67,31.24 10.67,30.91 10.64,30.89 10.64,30.38 U1.21 10.64,30.18 10.64,28.42 ENC28J60.10 8.79,26.49 7.39,25.09 7.39,19 DS1.4 7.39,18.77 7.39,17.65 10.72,14.33 10.72,11.48 v10.9,11.3 | 11.33,39.93 11.43,39.83 11.43,39.5 11.46,39.47 U1.5 | IC1.1 19.38,48.01 19.38,47.37 18.8,46.79 C1.- 13.18,46.89 10.54,49.53 6.68,49.53 5.87,48.72 RST.2 5.79,48.51 5.79,42.22 RST.1 5.77,42.01 5.77,40.18 4.52,38.94 3.99,38.94 C10.2 3.81,38.94 2.62,38.94 | C2.2 1.25,31.27 0.56,31.27 0.48,31.34 0.48,33.76 0.53,33.81 C11.1 1.42,33.81 1.96,33.81 v2.54,34.39 | 2.62,38.94 1.98,39.57 1.27,39.57 C12.1 | v2.54,38.76 2.62,38.94 | v11.46,39.93 11.33,39.93 | C8.1 22.91,36.02 22.94,35.99 22.94,33.86 C9.1 23.14,33.78 23.8,33.78 34.92,22.66 T2.E
N$1
  Bottom 0.406: R11.2 19.76,3.28 19.74,3.25 17.25,3.25 R10.1 17.07,3.94 17.07,1.7 LEFT.4 16.89,1.6 16.84,1.55 LEFT.3
N$2
  Bottom 0.406: R5.2 23.67,13.03 23.67,11.58 24.13,11.12 U$1.P$13
N$3
  Bottom 0.406: R4.2 21.13,13.03 21.13,11.58 21.59,11.12 U$1.P$12
N$4
  Bottom 0.406: R3.2 18.59,13.03 18.59,11.58 19.05,11.12 U$1.P$11
N$5
  Bottom 0.406: R2.2 16.05,13.03 16.05,11.58 16.51,11.12 U$1.P$10
N$6
  Bottom 0.406: R1.2 13.51,13.03 13.51,11.58 13.97,11.12 U$1.P$9
N$7  (1 unrouted)
N$8
  Bottom 0.406: DS1.1 3.58,19 3.58,20.24 3.33,20.5 3.33,21.54 X1.2
N$10  (via drill 0.3)
  Top 0.406: v39.37,37.44 40.74,38.81 40.74,38.84 41.15,39.24 41.68,39.24 45.14,42.7 45.14,47.19 46.28,48.34 Y1.1
  Bottom 0.406: v39.37,37.44 U$2.7
N$11  (via drill 0.3)
  Top 0.406: v39.06,40.23 40.13,40.23 40.79,40.89 40.79,42.85 39.88,43.76 38.94,43.76 USB.D-
  Bottom 0.406: U$2.6 38.1,39.27 v39.06,40.23
N$15
  Bottom 0.406: U$2.5 36.83,40.13 38.12,41.43 USB.D+
N$17
  Bottom 0.406: SJ2.1 44.42,29.84 44.42,28.96 44.12,28.65 R13.2
N$18
  Bottom 0.406: 21.64,3.28 R11.1 | 21.64,3.28 19.91,1.55 SELECT.3 | SELECT.4 23.44,1.55 21.82,3.17 21.64,3.28
N$26
  Top 0.457: T1.C 29.84,11.76 29.21,11.12 U$1.P$15
N$27  (via drill 0.3)
  Top 0.406: v12.6,41.91 16.43,45.74 30.66,45.74 31.55,44.86 31.55,39.29 33.05,37.8 33.05,30.81 32.31,30.07 32.31,25.07 v35.64,21.74
  Bottom 0.406: v12.6,41.91 R19.1 | v35.64,21.74 35.64,20.24 T2.B
N$28
  Bottom 0.406: SJ3.1 44.42,21.59 44.42,20.32 44.2,20.09 44.2,19.38 R14.2
N$29
  Top 0.406: T2.C 40.01,13.34 SG1.-
N$30
  Bottom 0.406: DS1.2 4.85,19 4.85,20.55 5.84,21.54 X1.1
N$31
  Bottom 0.406: SJ1.1 43.79,35.87 43.81,35.87 R12.2
N$32  (via drill 0.3)
  Top 0.406: v13.84,37.21 18.9,32.16 X2.1
  Bottom 0.406: v13.84,37.21 13.84,38.76 U1.8 | C9.2 22.94,32.13 18.92,32.13 X2.1
N$33
  Bottom 0.406: 18.22,37.91 18.9,37.24 X2.2 | 18.22,37.91 16.26,39.88 13.13,39.88 13.06,39.8 U1.7 | C8.2 22.89,37.74 21.21,37.74 20.9,38.05 18.36,38.05 18.22,37.91
N$35  (via drill 0.3)
  Top 0.406: v10.79,36.8 10.79,36.96 11.73,37.9 11.73,38.71 14.2,41.17 v14.2,42.49 | v25.4,39.98 27.08,39.98 27.23,39.83 27.23,35.99 27.13,35.89 27.13,34.72 24.56,32.16 v24.41,32.16 | v24.41,18.47 24.41,16 23.16,14.76 21.21,14.76 20.62,15.34 v20.32,15.34 | v9.47,11.71 9.58,11.81 9.58,14.38 7.21,16.74 6.35,16.74 5.94,17.14 5.94,18.24 4.19,19.99 3.66,19.99 3.23,20.42 2.95,20.42 2.18,21.18 v2.18,28.4
  Bottom 0.406: v10.79,36.8 10.79,36.4 11.46,35.74 U1.20 | v14.2,42.49 14.35,42.49 14.61,42.75 15.98,42.75 18.85,39.88 21.16,39.88 21.26,39.98 v25.4,39.98 | v24.41,18.47 v24.41,32.16 | v20.32,15.34 20.32,10.72 19.58,9.98 19.58,9.91 19.56,9.88 11.3,9.88 v9.47,11.71 | v2.18,28.4 2.18,29.34 1.96,29.57 C2.1
N$40  (via drill 0.3)
  Top 0.406: v41.45,38.53 41.55,38.63 41.94,38.63 Y1.3
  Bottom 0.406: U$2.8 40.64,39.12 41.02,39.12 41.45,38.68 v41.45,38.53
N$43
  Bottom 0.406: C17.1 U$2.14
N$44
  Bottom 0.406: T1.B 31.24,16.36 26.75,16.36 26.75,16.82 R6.1
RESET  (via drill 0.3)
  Top 0.406: v33.02,29.77 33.96,30.71 33.96,43.23 32.74,44.45 32.74,44.55 ISP.5 32.56,44.7 27.74,49.53 8.56,49.53 6.25,47.22 2.67,47.22 1.45,48.44 RST.4 1.25,48.51 0.48,47.75 0.48,42.67 1.07,42.09 RST.3 1.27,42.01 4.27,39.01 4.27,36.17 v4.17,36.07 | ENC28J60.8 10.79,27.3 10.79,28.09 10.57,28.32 10.57,32.11 v7.9,34.77
  Bottom 0.406: R116.1 40.34,22.86 40.34,23.52 35,28.85 34.29,28.85 C17.2 34.11,28.85 33.58,28.85 33.02,29.41 v33.02,29.77 | v4.17,36.07 4.37,36.07 5.54,34.9 6.73,34.9 U1.29 6.96,34.9 7.44,34.9 7.47,34.87 7.8,34.87 v7.9,34.77

### Text on the board
BoxDim: Serpac WM-032C Enclosure | All units are in inch | Left | Right | Front | Bottom